# Altium schematic sheet CorePort.SchDoc
size A3; SheetNumber: 1; SheetTotal: 2
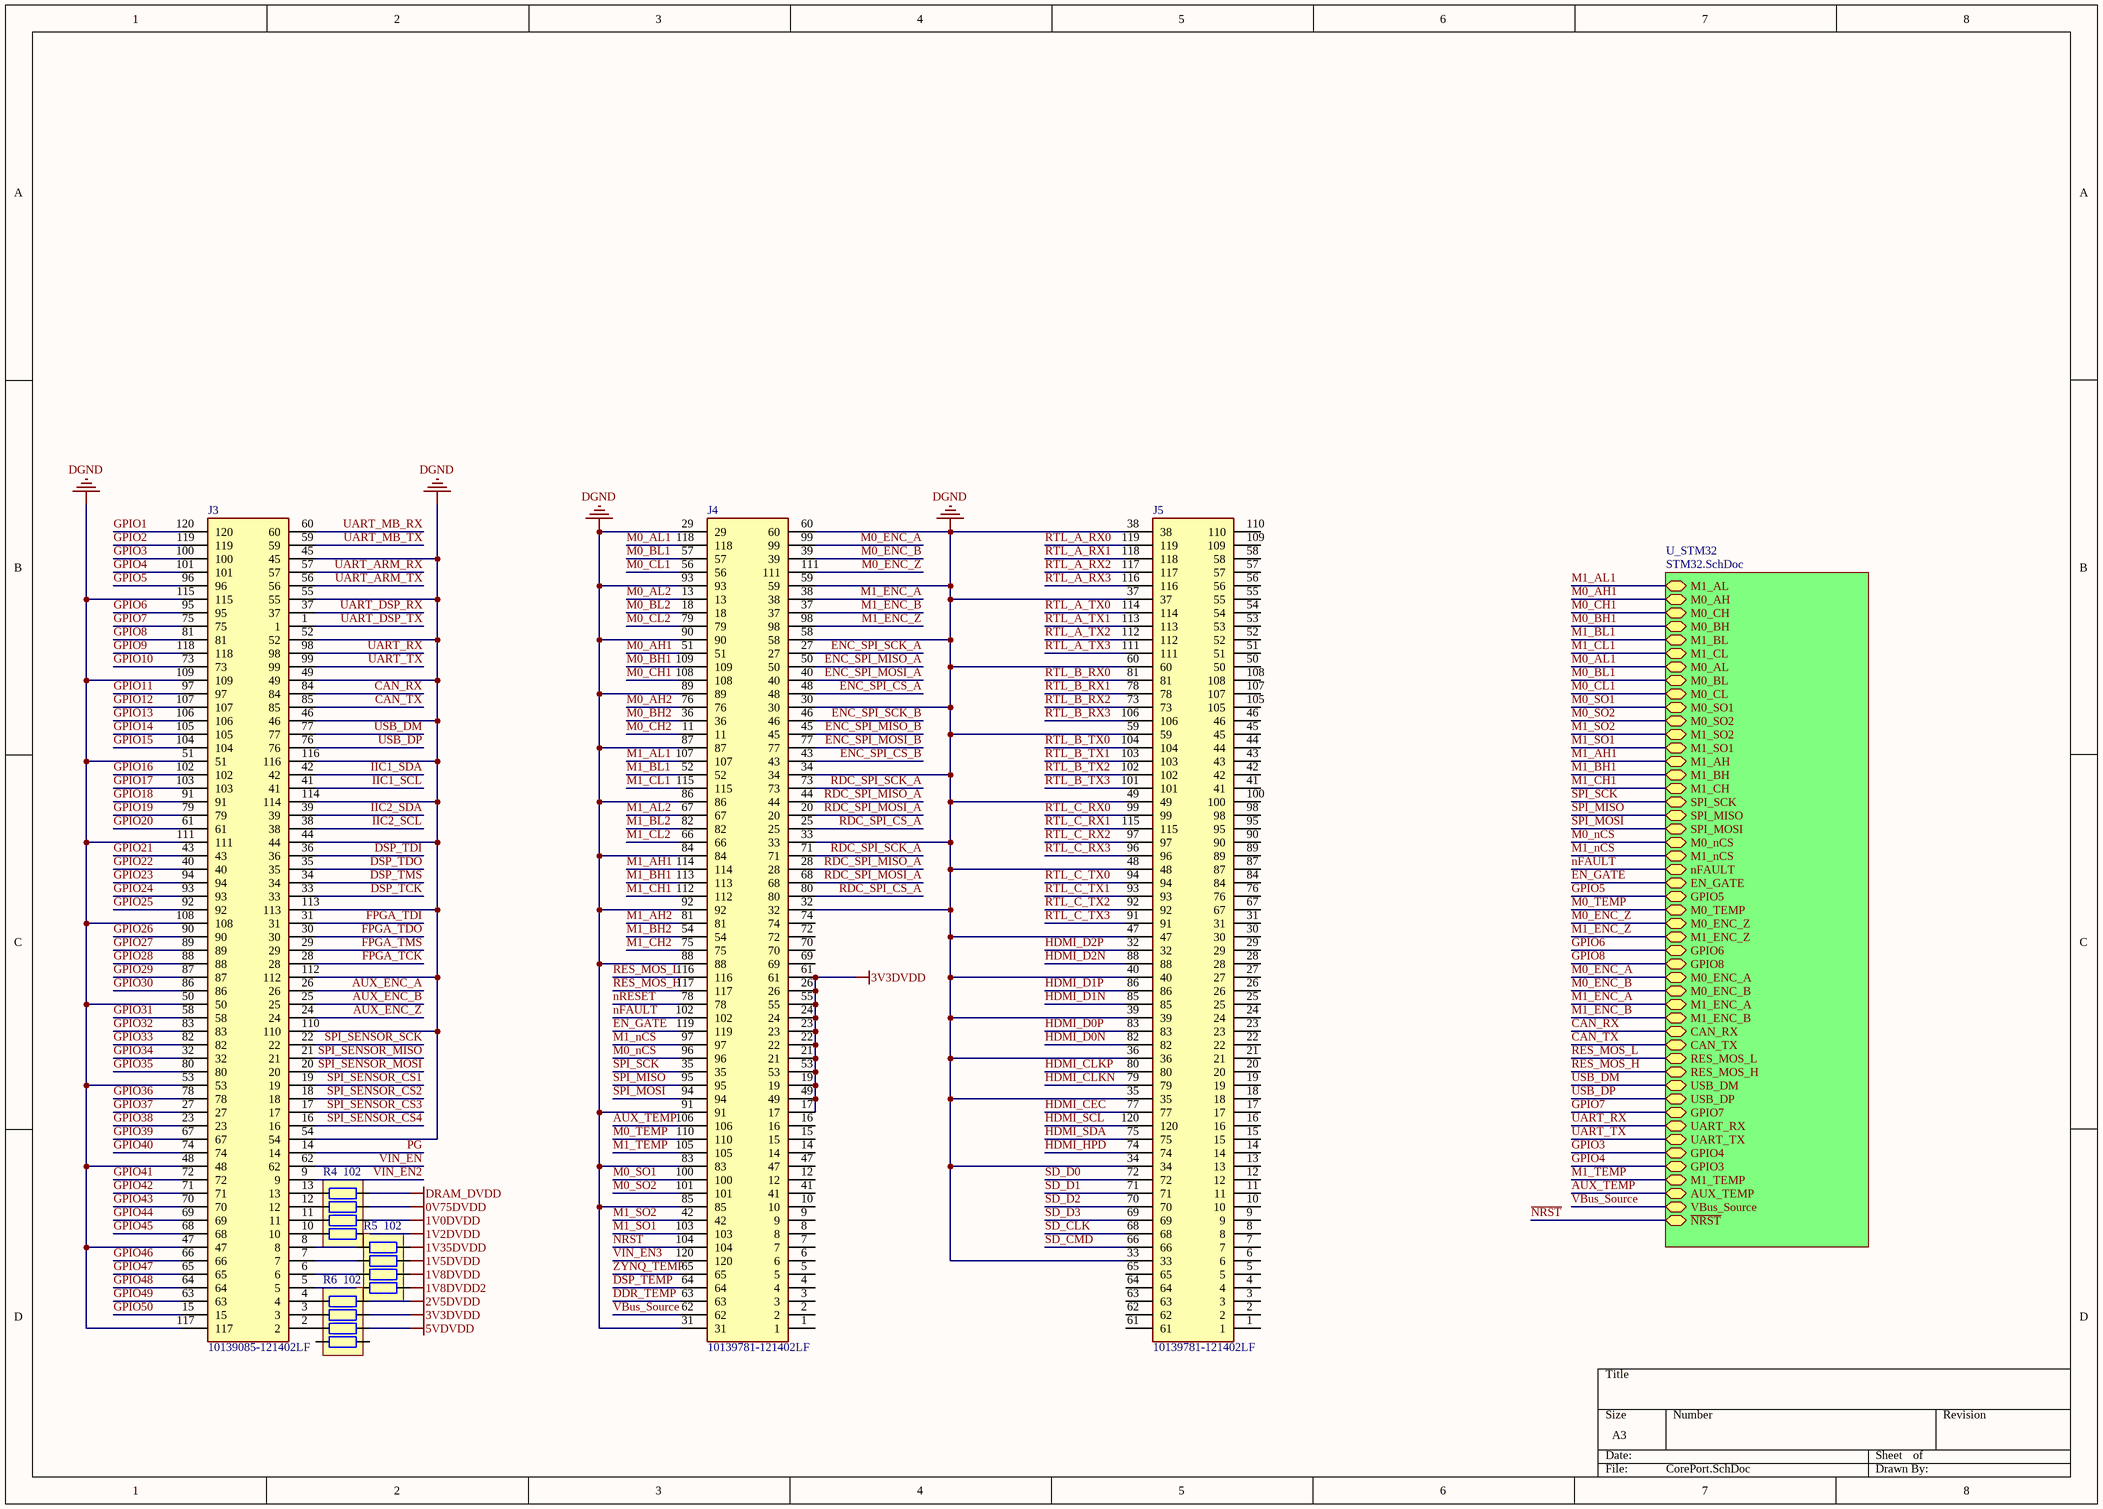
[diagram p0: CorePort.SchDoc]

## Parts
J3  10139085-121402LF  [10139085121402LF]
J4  10139781-121402LF  [10139781121402LF]
J5  10139781-121402LF  [10139781121402LF]
R4  102  [RCA-8P4R-0603]
R5  102  [RCA-8P4R-0603]
R6  102  [RCA-8P4R-0603]

## Sub-sheets
U_STM32 = STM32.SchDoc: M1_AL (bidir), M0_AH (bidir), M0_CH (bidir), M0_BH (bidir), M1_BL (bidir), M1_CL (bidir), M0_AL (bidir), M0_BL (bidir), M0_CL (bidir), M0_SO1 (bidir), M0_SO2 (bidir), M1_SO2 (bidir), M1_SO1 (bidir), M1_AH (bidir), M1_BH (bidir), M1_CH (bidir), SPI_SCK (bidir), SPI_MISO (bidir), SPI_MOSI (bidir), M0_nCS (bidir), M1_nCS (bidir), nFAULT (bidir), EN_GATE (bidir), GPIO5 (bidir), M0_TEMP (bidir), M0_ENC_Z (bidir), M1_ENC_Z (bidir), GPIO6 (bidir), GPIO8 (bidir), M0_ENC_A (bidir), M0_ENC_B (bidir), M1_ENC_A (bidir), M1_ENC_B (bidir), CAN_RX (bidir), CAN_TX (bidir), RES_MOS_L (bidir), RES_MOS_H (bidir), USB_DM (bidir), USB_DP (bidir), GPIO7 (bidir), UART_RX (bidir), UART_TX (bidir), GPIO4 (bidir), GPIO3 (bidir), M1_TEMP (bidir), AUX_TEMP (bidir), VBus_Source (bidir), ~{NRST} (bidir)

## Nets
0V75DVDD: R4.7
1V0DVDD: R4.6
1V2DVDD: R4.5
1V5DVDD: R5.7
1V8DVDD: R5.6
1V8DVDD2: R5.5
1V35DVDD: R5.8
2V5DVDD: R6.8
3V3DVDD: J4.17 J4.19 J4.21 J4.22 J4.23 J4.24 J4.26 J4.49 J4.53 J4.55 J4.61 R6.7
5VDVDD: R6.6
DGND: J3.44 J3.45 J3.46 J3.47 J3.48 J3.49 J3.50 J3.51 J3.52 J3.53 J3.54 J3.55 J3.108 J3.109 J3.110 J3.111 J3.112 J3.113 J3.114 J3.115 J3.116 J3.117 J4.29 J4.30 J4.31 J4.32 J4.33 J4.34 J4.58 J4.59 J4.60 J4.83 J4.84 J4.85 J4.86 J4.87 J4.88 J4.89 J4.90 J4.91 J4.92 J4.93 J5.33 J5.34 J5.35 J5.36 J5.37 J5.38 J5.39 J5.40 J5.47 J5.48 J5.49 J5.59 J5.60
DRAM_DVDD: R4.8
AUX_ENC_A: J3.26
AUX_ENC_B: J3.25
AUX_ENC_Z: J3.24
AUX_TEMP: J4.106 ; sheet U_STM32/AUX_TEMP
CAN_RX: J3.84 ; sheet U_STM32/CAN_RX
CAN_TX: J3.85 ; sheet U_STM32/CAN_TX
DDR_TEMP: J4.63
DSP_TCK: J3.33
DSP_TDI: J3.36
DSP_TDO: J3.35
DSP_TEMP: J4.64
DSP_TMS: J3.34
EN_GATE: J4.119 ; sheet U_STM32/EN_GATE
ENC_SPI_CS_A: J4.48
ENC_SPI_CS_B: J4.43
ENC_SPI_MISO_A: J4.50
ENC_SPI_MISO_B: J4.45
ENC_SPI_MOSI_A: J4.40
ENC_SPI_MOSI_B: J4.77
ENC_SPI_SCK_A: J4.27
ENC_SPI_SCK_B: J4.46
FPGA_TCK: J3.28
FPGA_TDI: J3.31
FPGA_TDO: J3.30
FPGA_TMS: J3.29
GPIO1: J3.120
GPIO2: J3.119
GPIO3: J3.100 ; sheet U_STM32/GPIO4
GPIO4: J3.101 ; sheet U_STM32/GPIO3
GPIO5: J3.96 ; sheet U_STM32/GPIO5
GPIO6: J3.95 ; sheet U_STM32/GPIO6
GPIO7: J3.75 ; sheet U_STM32/GPIO7
GPIO8: J3.81 ; sheet U_STM32/GPIO8
GPIO9: J3.118
GPIO10: J3.73
GPIO11: J3.97
GPIO12: J3.107
GPIO13: J3.106
GPIO14: J3.105
GPIO15: J3.104
GPIO16: J3.102
GPIO17: J3.103
GPIO18: J3.91
GPIO19: J3.79
GPIO20: J3.61
GPIO21: J3.43
GPIO22: J3.40
GPIO23: J3.94
GPIO24: J3.93
GPIO25: J3.92
GPIO26: J3.90
GPIO27: J3.89
GPIO28: J3.88
GPIO29: J3.87
GPIO30: J3.86
GPIO31: J3.58
GPIO32: J3.83
GPIO33: J3.82
GPIO34: J3.32
GPIO35: J3.80
GPIO36: J3.78
GPIO37: J3.27
GPIO38: J3.23
GPIO39: J3.67
GPIO40: J3.74
GPIO41: J3.72
GPIO42: J3.71
GPIO43: J3.70
GPIO44: J3.69
GPIO45: J3.68
GPIO46: J3.66
GPIO47: J3.65
GPIO48: J3.64
GPIO49: J3.63
GPIO50: J3.15
HDMI_CEC: J5.77
HDMI_CLKN: J5.79
HDMI_CLKP: J5.80
HDMI_D0N: J5.82
HDMI_D0P: J5.83
HDMI_D1N: J5.85
HDMI_D1P: J5.86
HDMI_D2N: J5.88
HDMI_D2P: J5.32
HDMI_HPD: J5.74
HDMI_SCL: J5.120
HDMI_SDA: J5.75
IIC1_SCL: J3.41
IIC1_SDA: J3.42
IIC2_SCL: J3.38
IIC2_SDA: J3.39
M0_AH1: J4.51 ; sheet U_STM32/M0_AH
M0_AH2: J4.76
M0_AL1: J4.118 ; sheet U_STM32/M0_AL
M0_AL2: J4.13
M0_BH1: J4.109 ; sheet U_STM32/M0_BH
M0_BH2: J4.36
M0_BL1: J4.57 ; sheet U_STM32/M0_BL
M0_BL2: J4.18
M0_CH1: J4.108 ; sheet U_STM32/M0_CH
M0_CH2: J4.11
M0_CL1: J4.56 ; sheet U_STM32/M0_CL
M0_CL2: J4.79
M0_ENC_A: J4.99 ; sheet U_STM32/M0_ENC_A
M0_ENC_B: J4.39 ; sheet U_STM32/M0_ENC_B
M0_ENC_Z: J4.111 ; sheet U_STM32/M0_ENC_Z
M0_nCS: J4.96 ; sheet U_STM32/M0_nCS
M0_SO1: J4.100 ; sheet U_STM32/M0_SO1
M0_SO2: J4.101 ; sheet U_STM32/M0_SO2
M0_TEMP: J4.110 ; sheet U_STM32/M0_TEMP
M1_AH1: J4.114 ; sheet U_STM32/M1_AH
M1_AH2: J4.81
M1_AL1: J4.107 ; sheet U_STM32/M1_AL
M1_AL2: J4.67
M1_BH1: J4.113 ; sheet U_STM32/M1_BH
M1_BH2: J4.54
M1_BL1: J4.52 ; sheet U_STM32/M1_BL
M1_BL2: J4.82
M1_CH1: J4.112 ; sheet U_STM32/M1_CH
M1_CH2: J4.75
M1_CL1: J4.115 ; sheet U_STM32/M1_CL
M1_CL2: J4.66
M1_ENC_A: J4.38 ; sheet U_STM32/M1_ENC_A
M1_ENC_B: J4.37 ; sheet U_STM32/M1_ENC_B
M1_ENC_Z: J4.98 ; sheet U_STM32/M1_ENC_Z
M1_nCS: J4.97 ; sheet U_STM32/M1_nCS
M1_SO1: J4.103 ; sheet U_STM32/M1_SO1
M1_SO2: J4.42 ; sheet U_STM32/M1_SO2
M1_TEMP: J4.105 ; sheet U_STM32/M1_TEMP
~{NRST}: J4.104 ; sheet U_STM32/~{NRST}
nFAULT: J4.102 ; sheet U_STM32/nFAULT
nRESET: J4.78
PG: J3.14
RDC_SPI_CS_A: J4.25 J4.80
RDC_SPI_MISO_A: J4.28 J4.44
RDC_SPI_MOSI_A: J4.20 J4.68
RDC_SPI_SCK_A: J4.71 J4.73
RES_MOS_H: J4.117 ; sheet U_STM32/RES_MOS_H
RES_MOS_L: J4.116 ; sheet U_STM32/RES_MOS_L
RTL_A_RX0: J5.119
RTL_A_RX1: J5.118
RTL_A_RX2: J5.117
RTL_A_RX3: J5.116
RTL_A_TX0: J5.114
RTL_A_TX1: J5.113
RTL_A_TX2: J5.112
RTL_A_TX3: J5.111
RTL_B_RX0: J5.81
RTL_B_RX1: J5.78
RTL_B_RX2: J5.73
RTL_B_RX3: J5.106
RTL_B_TX0: J5.104
RTL_B_TX1: J5.103
RTL_B_TX2: J5.102
RTL_B_TX3: J5.101
RTL_C_RX0: J5.99
RTL_C_RX1: J5.115
RTL_C_RX2: J5.97
RTL_C_RX3: J5.96
RTL_C_TX0: J5.94
RTL_C_TX1: J5.93
RTL_C_TX2: J5.92
RTL_C_TX3: J5.91
SD_CLK: J5.68
SD_CMD: J5.66
SD_D0: J5.72
SD_D1: J5.71
SD_D2: J5.70
SD_D3: J5.69
SPI_MISO: J4.95 ; sheet U_STM32/SPI_MISO
SPI_MOSI: J4.94 ; sheet U_STM32/SPI_MOSI
SPI_SCK: J4.35 ; sheet U_STM32/SPI_SCK
SPI_SENSOR_CS1: J3.19
SPI_SENSOR_CS2: J3.18
SPI_SENSOR_CS3: J3.17
SPI_SENSOR_CS4: J3.16
SPI_SENSOR_MISO: J3.21
SPI_SENSOR_MOSI: J3.20
SPI_SENSOR_SCK: J3.22
UART_ARM_RX: J3.57
UART_ARM_TX: J3.56
UART_DSP_RX: J3.37
UART_DSP_TX: J3.1
UART_MB_RX: J3.60
UART_MB_TX: J3.59
UART_RX: J3.98 ; sheet U_STM32/UART_RX
UART_TX: J3.99 ; sheet U_STM32/UART_TX
USB_DM: J3.77 ; sheet U_STM32/USB_DM
USB_DP: J3.76 ; sheet U_STM32/USB_DP
VBus_Source: J4.62 ; sheet U_STM32/VBus_Source
VIN_EN: J3.62
VIN_EN2: J3.9
VIN_EN3: J4.120
ZYNQ_TEMP: J4.65
NetJ3_2: J3.2 R6.3
NetJ3_3: J3.3 R6.2
NetJ3_4: J3.4 R6.1
NetJ3_5: J3.5 R5.4
NetJ3_6: J3.6 R5.3
NetJ3_7: J3.7 R5.2
NetJ3_8: J3.8 R5.1
NetJ3_10: J3.10 R4.4
NetJ3_11: J3.11 R4.3
NetJ3_12: J3.12 R4.2
NetJ3_13: J3.13 R4.1

Not connected (* = marked no-connect by the designer): J4 1 2 3 4 5 6 7 8 9 10 12 14 15 16 41 47 69 70 72 74; J5 1 2 3 4 5 6 7 8 9 10 11 12 13 14 15 16 17 18 19 20 21 22 23 24 25 26 27 28 29 30 31 41 42 43 44 45 46 50 51 52 53 54 55 56 57 58 61 62 63 64 65 67 76 84 87 89 90 95 98 100 105 107 108 109 110; R6 4 5

## Library data of the parts
J3 = 10139085-121402LF: Connector FE; Manufacturer_Name: Amphenol Communications Solutions; Manufacturer_Part_Number: 10139781-121402LF; Datasheet Link: https://cdn.amphenol-cs.com/media/wysiwyg/files/drawing/10139781.pdf; Height: 4.3mm
J4 J5 = 10139781-121402LF: Connector M; Manufacturer_Name: Amphenol Communications Solutions; Datasheet Link: https://cdn.amphenol-cs.com/media/wysiwyg/files/drawing/10139781.pdf; Height: 4.3mm; Manufacturer_Part_Number: 10139781-121402LF
R4-R6 = R-8P4R: 贴片排阻; BOM名称: 贴片网络排阻; 版权归属: 封装库来自淘宝 ID：黄晶宝石; 联系售后: https://shop463601444.taobao.com